# EAGLE design control_board_v2 (EAGLE 8.4.3)
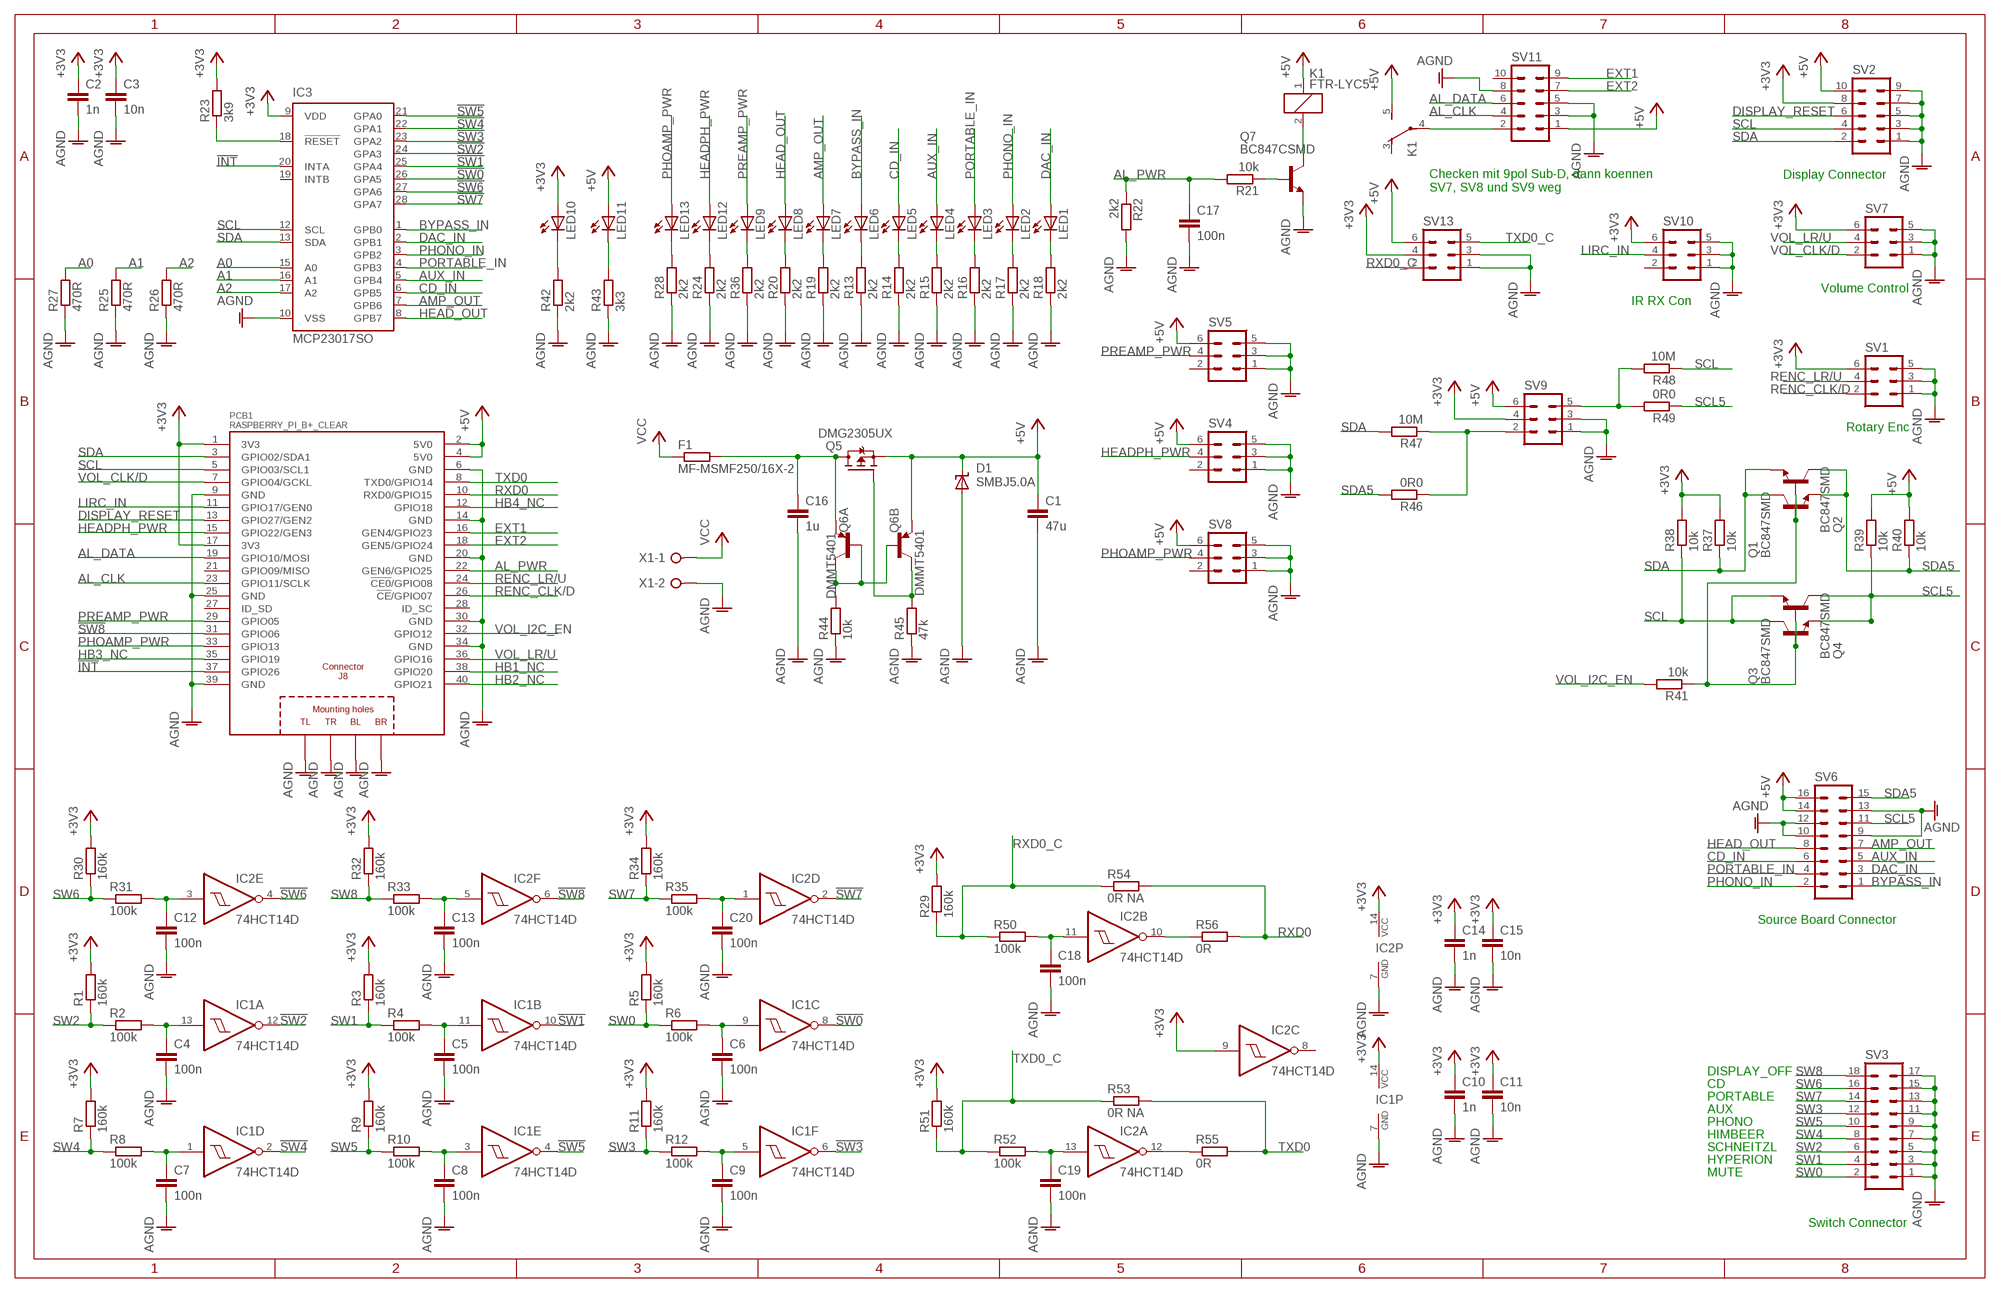
[diagram p0: schematic, sheet 1]

## Parts
C1  47u  C-EUC1812  [C1812]
C2  1n  C-EUC0603  [C0603]
C3  10n  C-EUC0603  [C0603]
C4  100n  C-EUC0603  [C0603]
C5  100n  C-EUC0603  [C0603]
C6  100n  C-EUC0603  [C0603]
C7  100n  C-EUC0603  [C0603]
C8  100n  C-EUC0603  [C0603]
C9  100n  C-EUC0603  [C0603]
C10  1n  C-EUC0603  [C0603]
C11  10n  C-EUC0603  [C0603]
C12  100n  C-EUC0603  [C0603]
C13  100n  C-EUC0603  [C0603]
C14  1n  C-EUC0603  [C0603]
C15  10n  C-EUC0603  [C0603]
C16  1u  C-EUC1206  [C1206]
C17  100n  C-EUC0603  [C0603]
C18  100n  C-EUC0603  [C0603]
C19  100n  C-EUC0603  [C0603]
C20  100n  C-EUC0603  [C0603]
D1  SMBJ5.0A  [SMBJ]
F1  MF-MSMF250/16X-2  R-EU_1812X7R  [1812X7R]
IC1  74HCT14D  [SO14]
IC2  74HCT14D  [SO14]
IC3  MCP23017SO  [SO28W]
K1  FTR-LYC5  [FTR-LYC]
LED1  LEDCHIPLED_0603  [CHIPLED_0603]
LED2  LEDCHIPLED_0603  [CHIPLED_0603]
LED3  LEDCHIPLED_0603  [CHIPLED_0603]
LED4  LEDCHIPLED_0603  [CHIPLED_0603]
LED5  LEDCHIPLED_0603  [CHIPLED_0603]
LED6  LEDCHIPLED_0603  [CHIPLED_0603]
LED7  LEDCHIPLED_0603  [CHIPLED_0603]
LED8  LEDCHIPLED_0603  [CHIPLED_0603]
LED9  LEDCHIPLED_0603  [CHIPLED_0603]
LED10  LEDCHIPLED_0603  [CHIPLED_0603]
LED11  LEDCHIPLED_0603  [CHIPLED_0603]
LED12  LEDCHIPLED_0603  [CHIPLED_0603]
LED13  LEDCHIPLED_0603  [CHIPLED_0603]
PCB1  RASPBERRY_PI_B+_CLEAR  [RASPBERRY_PI_PLUS_CLEAR]
Q1  BC847SMD  [SOT23]
Q2  BC847SMD  [SOT23]
Q3  BC847SMD  [SOT23]
Q4  BC847SMD  [SOT23]
Q5  DMG2305UX  [SOT23]
Q6  DMMT5401  [SOT23-6]
Q7  BC847CSMD  [SOT23]
R1  160k  R-EU_R0603  [R0603]
R2  100k  R-EU_R0603  [R0603]
R3  160k  R-EU_R0603  [R0603]
R4  100k  R-EU_R0603  [R0603]
R5  160k  R-EU_R0603  [R0603]
R6  100k  R-EU_R0603  [R0603]
R7  160k  R-EU_R0603  [R0603]
R8  100k  R-EU_R0603  [R0603]
R9  160k  R-EU_R0603  [R0603]
R10  100k  R-EU_R0603  [R0603]
R11  160k  R-EU_R0603  [R0603]
R12  100k  R-EU_R0603  [R0603]
R13  2k2  R-EU_R0603  [R0603]
R14  2k2  R-EU_R0603  [R0603]
R15  2k2  R-EU_R0603  [R0603]
R16  2k2  R-EU_R0603  [R0603]
R17  2k2  R-EU_R0603  [R0603]
R18  2k2  R-EU_R0603  [R0603]
R19  2k2  R-EU_R0603  [R0603]
R20  2k2  R-EU_R0603  [R0603]
R21  10k  R-EU_R0603  [R0603]
R22  2k2  R-EU_R0603  [R0603]
R23  3k9  R-EU_R1206  [R1206]
R24  2k2  R-EU_R0603  [R0603]
R25  470R  R-EU_R0603  [R0603]
R26  470R  R-EU_R0603  [R0603]
R27  470R  R-EU_R0603  [R0603]
R28  2k2  R-EU_R0603  [R0603]
R29  160k  R-EU_R0603  [R0603]
R30  160k  R-EU_R0603  [R0603]
R31  100k  R-EU_R0603  [R0603]
R32  160k  R-EU_R0603  [R0603]
R33  100k  R-EU_R0603  [R0603]
R34  160k  R-EU_R0603  [R0603]
R35  100k  R-EU_R0603  [R0603]
R36  2k2  R-EU_R0603  [R0603]
R37  10k  R-EU_R1206  [R1206]
R38  10k  R-EU_R0603  [R0603]
R39  10k  R-EU_R0603  [R0603]
R40  10k  R-EU_R0603  [R0603]
R41  10k  R-EU_R1206  [R1206]
R42  2k2  R-EU_R0603  [R0603]
R43  3k3  R-EU_R0603  [R0603]
R44  10k  R-EU_R0603  [R0603]
R45  47k  R-EU_R0603  [R0603]
R46  0R0  R-EU_R0603  [R0603]
R47  10M  R-EU_R0603  [R0603]
R48  10M  R-EU_R0603  [R0603]
R49  0R0  R-EU_R0603  [R0603]
R50  100k  R-EU_R0603  [R0603]
R51  160k  R-EU_R0603  [R0603]
R52  100k  R-EU_R0603  [R0603]
R53  0R NA  R-EU_R0603  [R0603]
R54  0R NA  R-EU_R0603  [R0603]
R55  0R  R-EU_R0603  [R0603]
R56  0R  R-EU_R0603  [R0603]
SV1  MA03-2B  [MA03-2_BORDER]
SV2  MA05-2B  [MA05-2_BORDER]
SV3  MA09-2B  [MA09-2_BORDER]
SV4  MA03-2B  [MA03-2_BORDER]
SV5  MA03-2B  [MA03-2_BORDER]
SV6  MA08-2B  [MA08-2_BORDER]
SV7  MA03-2B  [MA03-2_BORDER]
SV8  MA03-2B  [MA03-2_BORDER]
SV9  MA03-2B  [MA03-2_BORDER]
SV10  MA03-2B  [MA03-2_BORDER]
SV11  MA05-2B  [MA05-2_BORDER]
SV13  MA03-2B  [MA03-2_BORDER]
X1  W237-02P  [W237-132]

## Nets
!INT: IC3.20(INTA) PCB1.37(GPIO26)
!SW0: IC1.8(C:O) IC3.26(GPA5)
!SW1: IC1.10(B:O) IC3.25(GPA4)
!SW2: IC1.12(A:O) IC3.24(GPA3)
!SW3: IC1.6(F:O) IC3.23(GPA2)
!SW4: IC1.2(D:O) IC3.22(GPA1)
!SW5: IC1.4(E:O) IC3.21(GPA0)
!SW6: IC2.4(E:O) IC3.27(GPA6)
!SW7: IC2.2(D:O) IC3.28(GPA7)
!SW8: IC2.6(F:O) PCB1.31(GPIO06)
+3V3: C2.1 C3.1 C10.1 C11.1 C14.1 C15.1 IC1.14(P:VCC) IC2.9(C:I) IC2.14(P:VCC) IC3.9(VDD) LED10.A PCB1.1(3V3) PCB1.17(3V3) R1.2 R3.2 R5.2 R7.2 R9.2 R11.2 R23.2 R29.2 R30.2 R32.2 R34.2 R37.2 R38.2 R51.2 SV1.6 SV2.8 SV7.6 SV9.4 SV10.6 SV13.4
+5V: C1.1 D1.C K1.1 K1.5(-1:S) LED11.A PCB1.2(5V0) PCB1.4(5V0) Q5.2(S) Q6.5(B:E) R39.2 R40.2 SV2.10 SV4.6 SV5.6 SV6.14 SV6.16 SV8.6 SV9.6 SV11.1 SV13.6
A0: IC3.15(A0) R27.2
A1: IC3.16(A1) R25.2
A2: IC3.17(A2) R26.2
AGND: C1.2 C2.2 C3.2 C4.2 C5.2 C6.2 C7.2 C8.2 C9.2 C10.2 C11.2 C12.2 C13.2 C14.2 C15.2 C16.2 C17.2 C18.2 C19.2 C20.2 D1.A IC1.7(P:GND) IC2.7(P:GND) IC3.10(VSS) PCB1.6(GND) PCB1.9(GND) PCB1.14(GND) PCB1.20(GND) PCB1.25(GND) PCB1.30(GND) PCB1.34(GND) PCB1.39(GND) PCB1.PE_BL(BL) PCB1.PE_BR(BR) PCB1.PE_TL(TL) PCB1.PE_TR(TR) Q7.2(E) R13.1 R14.1 R15.1 R16.1 R17.1 R18.1 R19.1 R20.1 R22.2 R24.1 R25.1 R26.1 R27.1 R28.1 R36.1 R42.1 R43.1 R44.1 R45.1 SV1.1 SV1.3 SV1.5 SV2.1 SV2.3 SV2.5 SV2.7 SV2.9 SV3.1 SV3.3 SV3.5 SV3.7 SV3.9 SV3.11 SV3.13 SV3.15 SV3.17 SV4.1 SV4.3 SV4.5 SV5.1 SV5.3 SV5.5 SV6.9 SV6.10 SV6.12 SV6.13 SV7.1 SV7.3 SV7.5 SV8.1 SV8.3 SV8.5 SV9.1 SV9.3 SV10.1 SV10.3 SV10.5 SV11.3 SV11.5 SV11.8 SV13.1 SV13.3 X1.2
AL_CLK: PCB1.23(GPIO11/SCLK) SV11.4
AL_DATA: PCB1.19(GPIO10/MOSI) SV11.6
AL_PWR: C17.1 PCB1.22(GEN6/GPIO25) R21.2 R22.1
AMP_OUT: IC3.7(GPB6) LED7.A SV6.7
AUX_IN: IC3.5(GPB4) LED4.A SV6.5
BYPASS_IN: IC3.1(GPB0) LED6.A SV6.1
CD_IN: IC3.6(GPB5) LED5.A SV6.6
DAC_IN: IC3.2(GPB1) LED1.A SV6.3
DISPLAY_RESET: PCB1.13(GPIO27/GEN2) SV2.6
EXT1: PCB1.16(GEN4/GPIO23) SV11.9
EXT2: PCB1.18(GEN5/GPIO24) SV11.7
HB1_NC: PCB1.38(GPIO20)
HB2_NC: PCB1.40(GPIO21)
HB3_NC: PCB1.35(GPIO19)
HB4_NC: PCB1.12(GPIO18)
HEAD_OUT: IC3.8(GPB7) LED8.A SV6.8
HEADPH_PWR: LED12.A PCB1.15(GPIO22/GEN3) SV4.4
LIRC_IN: PCB1.11(GPIO17/GEN0) SV10.4
N$1: C20.1 IC2.1(D:I) R35.2
N$2: LED13.C R28.2
N$3: LED12.C R24.2
N$4: LED9.C R36.2
N$5: LED8.C R20.2
N$6: LED7.C R19.2
N$7: LED6.C R13.2
N$8: LED3.C R16.2
N$9: LED4.C R15.2
N$10: LED5.C R14.2
N$11: C12.1 IC2.3(E:I) R31.2
N$12: C4.1 IC1.13(A:I) R2.2
N$13: C13.1 IC2.5(F:I) R33.2
N$14: C5.1 IC1.11(B:I) R4.2
N$15: IC3.18(!RESET) R23.1
N$16: C6.1 IC1.9(C:I) R6.2
N$17: Q1.1(B) Q2.1(B) Q3.1(B) Q4.1(B) R41.1
N$18: C7.1 IC1.1(D:I) R8.2
N$19: Q6.1(A:C) Q6.2(A:B) Q6.3(B:B) R44.2
N$20: C8.1 IC1.3(E:I) R10.2
N$21: K1.4(-1:P) SV11.2
N$22: LED11.C R43.2
N$23: C9.1 IC1.5(F:I) R12.2
N$24: LED10.C R42.2
N$25: Q5.1(G) Q6.4(B:C) R45.2
N$26: C16.1 F1.2 Q5.3(D) Q6.6(A:E)
N$27: Q7.1(B) R21.1
N$28: K1.2 Q7.3(C)
N$29: C18.1 IC2.11(B:I) R50.2
N$30: LED1.C R18.2
N$31: C19.1 IC2.13(A:I) R52.2
N$32: IC2.12(A:O) R55.1
N$33: IC2.10(B:O) R56.1
N$34: LED2.C R17.2
N$35: R48.2 R49.2 SV9.5
N$37: R46.1 R47.1 SV9.2
PHOAMP_PWR: LED13.A PCB1.33(GPIO13) SV8.4
PHONO_IN: IC3.3(GPB2) LED2.A SV6.2
PORTABLE_IN: IC3.4(GPB3) LED3.A SV6.4
PREAMP_PWR: LED9.A PCB1.29(GPIO05) SV5.4
RENC_CLK/D: PCB1.26(!CE!/GPIO07) SV1.2
RENC_LR/U: PCB1.24(!CE0!/GPIO08) SV1.4
RXD0: PCB1.10(RXD0/GPIO15) R54.2 R56.2
RXD0_C: R29.1 R50.1 R54.1 SV13.2
SCL: IC3.12(SCL) PCB1.5(GPIO03/SCL1) Q3.3(C) Q4.2(E) R38.1 R48.1 SV2.4
SCL5: Q3.2(E) Q4.3(C) R39.1 R49.1 SV6.11
SDA: IC3.13(SDA) PCB1.3(GPIO02/SDA1) Q1.3(C) Q2.2(E) R37.1 R47.2 SV2.2
SDA5: Q1.2(E) Q2.3(C) R40.1 R46.2 SV6.15
SW0: R5.1 R6.1 SV3.2
SW1: R3.1 R4.1 SV3.4
SW2: R1.1 R2.1 SV3.6
SW3: R11.1 R12.1 SV3.12
SW4: R7.1 R8.1 SV3.8
SW5: R9.1 R10.1 SV3.10
SW6: R30.1 R31.1 SV3.16
SW7: R34.1 R35.1 SV3.14
SW8: R32.1 R33.1 SV3.18
TXD0: PCB1.8(TXD0/GPIO14) R53.2 R55.2
TXD0_C: R51.1 R52.1 R53.1 SV13.5
VCC: F1.1 X1.1
VOL_CLK/D: PCB1.7(GPIO04/GCKL) SV7.2
VOL_I2C_EN: PCB1.32(GPIO12) R41.2
VOL_LR/U: PCB1.36(GPIO16) SV7.4
Unconnected: IC2.8(C:O) IC3.19(INTB) K1.3(-1:O) PCB1.21(GPIO09/MISO) PCB1.27(ID_SD) PCB1.28(ID_SC) SV4.2 SV5.2 SV8.2 SV10.2 SV11.10

## Notes on the sheet
- Display Connector
- Checken mit 9pol Sub-D, dann koennen
  SV7, SV8 und SV9 weg
- Volume Control
- IR RX Con
- Rotary Enc
- Source Board Connector
- DISPLAY_OFF
- CD
- PORTABLE
- AUX
- PHONO
- HIMBEER
- SCHNEITZL
- HYPERION
- MUTE
- Switch Connector

## Library data of the parts
C1-C20 = rcl:C-EU: CAPACITOR, European symbol
D1 = diode:SMBJ5.0A
F1 R1-R36 R40 R42-R56 = rcl:R-EU_: RESISTOR, European symbol
IC1 IC2 = 74xx-eu:74*14: Hex schmitt trigger INVERTER
IC3 = microchip:MCP23017: http://ww1.microchip.com/downloads/en/DeviceDoc/21952a.pdf Source: http://ww1.microchip.com/downloads/en/DeviceDoc/21952a.pdf; MF: MICROCHIP; MPN: MCP23017-E/SO; OC_FARNELL: 1332087; OC_NEWARK: 31K2958
K1 = relay:FTR-LYC: Schmales Netzrelais NETZRELAIS FTR-LYCA024V 1XUM 6A/250VAC Distributor: Conrad electronic Bestell Nr.: 504382 - 62 Source: http://www2.produktinfo.conrad.com/datenblaetter/500000-524999/504382-da-01-de-NETZRELAIS_FTR-LYCA024V_1XUM_6A_250VAC.pdf; OC_FARNELL: unknown; OC_NEWARK: unknown
LED1-LED13 = led:LED: LED OSRAM: - CHIPLED LG R971, LG N971, LY N971, LG Q971, LY Q971, LO R971, LY R971 LH N974, LH R974 LS Q976, LO Q976, LY Q976 LO Q996 - Hyper CHIPLED LW Q18S LB Q993, LB Q99A, LB R99A - SideLED LS A670, LO A670, LY A670, LG A670, LP A670 LB A673, LV A673, LT A673, LW A673 LH A674 LY A675 LS A676, LA A676, LO A676, LY A676, LW A676 LS A679, LY A679, LG A679 - Hyper Micro SIDELED® LS Y876, LA Y876, LO Y876, LY Y876 LT Y87S - SmartLED LW L88C, LW L88S LB L89C, LB L89S, LG L890 LS L89K, LO L89K, LY L89K LS L896, LA L896, LO L896, LY L896 - TOPLED LS T670, LO T670, LY T670, LG T670, LP T670 LSG T670, LSP T670, LSY T670, LOP T670, LYG T670 LG T671, LOG T671, LSG T671 LB T673, LV T673, LT T673, LW T673 LH T674 LS T676, LA T676, LO T676, LY T676, LB T676, LH T676, LSB T676, LW T676 LB T67C, LV T67C, LT T67C, LS T67K, LO T67K, LY T67K, LW E67C LS E67B, LA E67B, LO E67B, LY E67B, LB E67C, LV E67C, LT E67C LW T67C LS T679, LY T679, LG T679 LS T770, LO T770, LY T770, LG T770, LP T770 LB T773, LV T773, LT T773, LW T773 LH T774 LS E675, LA E675, LY E675, LS T675 LS T776, LA T776, LO T776, LY T776, LB T776 LHGB T686 LT T68C, LB T68C - Hyper Mini TOPLED® LB M676 - Mini TOPLED Santana® LG M470 LS M47K, LO M47K, LY M47K Source: http://www.osram.convergy.de LUXEON: - LUMILED® LXK2-PW12-R00, LXK2-PW12-S00, LXK2-PW14-U00, LXK2-PW14-V00 LXK2-PM12-R00, LXK2-PM12-S00, LXK2-PM14-U00 LXK2-PE12-Q00, LXK2-PE12-R00, LXK2-PE12-S00, LXK2-PE14-T00, LXK2-PE14-U00 LXK2-PB12-K00, LXK2-PB12-L00, LXK2-PB12-M00, LXK2-PB14-N00, LXK2-PB14-P00, LXK2-PB14-Q00 LXK2-PR12-L00, LXK2-PR12-M00, LXK2-PR14-Q00, LXK2-PR14-R00 LXK2-PD12-Q00, LXK2-PD12-R00, LXK2-PD12-S00 LXK2-PH12-R00, LXK2-PH12-S00 LXK2-PL12-P00, LXK2-PL12-Q00, LXK2-PL12-R00 Source: www.luxeon.com KINGBRIGHT: KA-3528ASYC Source: www.kingbright.com
PCB1 = RASPBERRY_PI_Bplus:RASPBERRY_PI_B+: Raspberry Pi B+ Basedon issue: Thursday, July 10, 2014 - Rev 1.2 LBR by Tim Rettmann 07-2014
Q1-Q4 Q7 = transistor-npn:BC847*: NPN Transistor
Q5 = transistor-fet:DMG2305UX
Q6 = transistor-pnp:DMMT5401
R37-R39 R41 = resistor:R-EU_: RESISTOR, European symbol
SV1 SV4 SV5 SV7-SV10 SV13 = con-lstb:MA03-2: PIN HEADER
SV2 SV11 = con-lstb:MA05-2: PIN HEADER
SV3 = con-lstb:MA09-2: PIN HEADER
SV6 = con-lstb:MA08-2: PIN HEADER
X1 = con-wago-508:W237-02P: WAGO SREW CLAMP; OC_FARNELL: unknown; OC_NEWARK: unknown

## Board
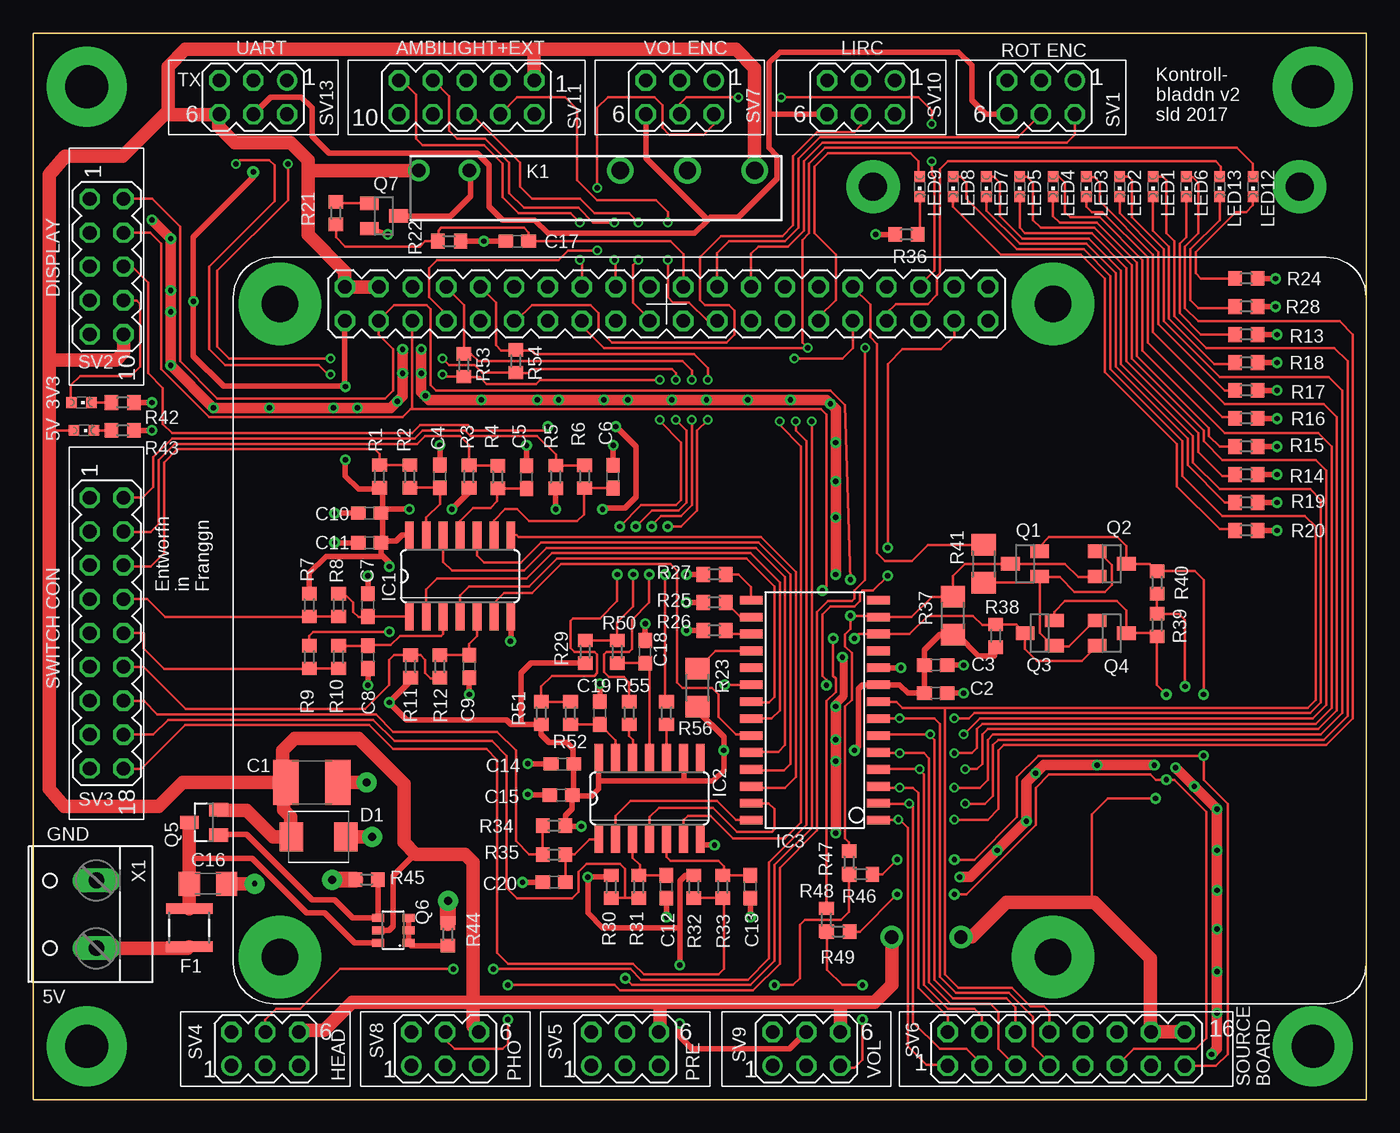
[diagram p1: board, top side]
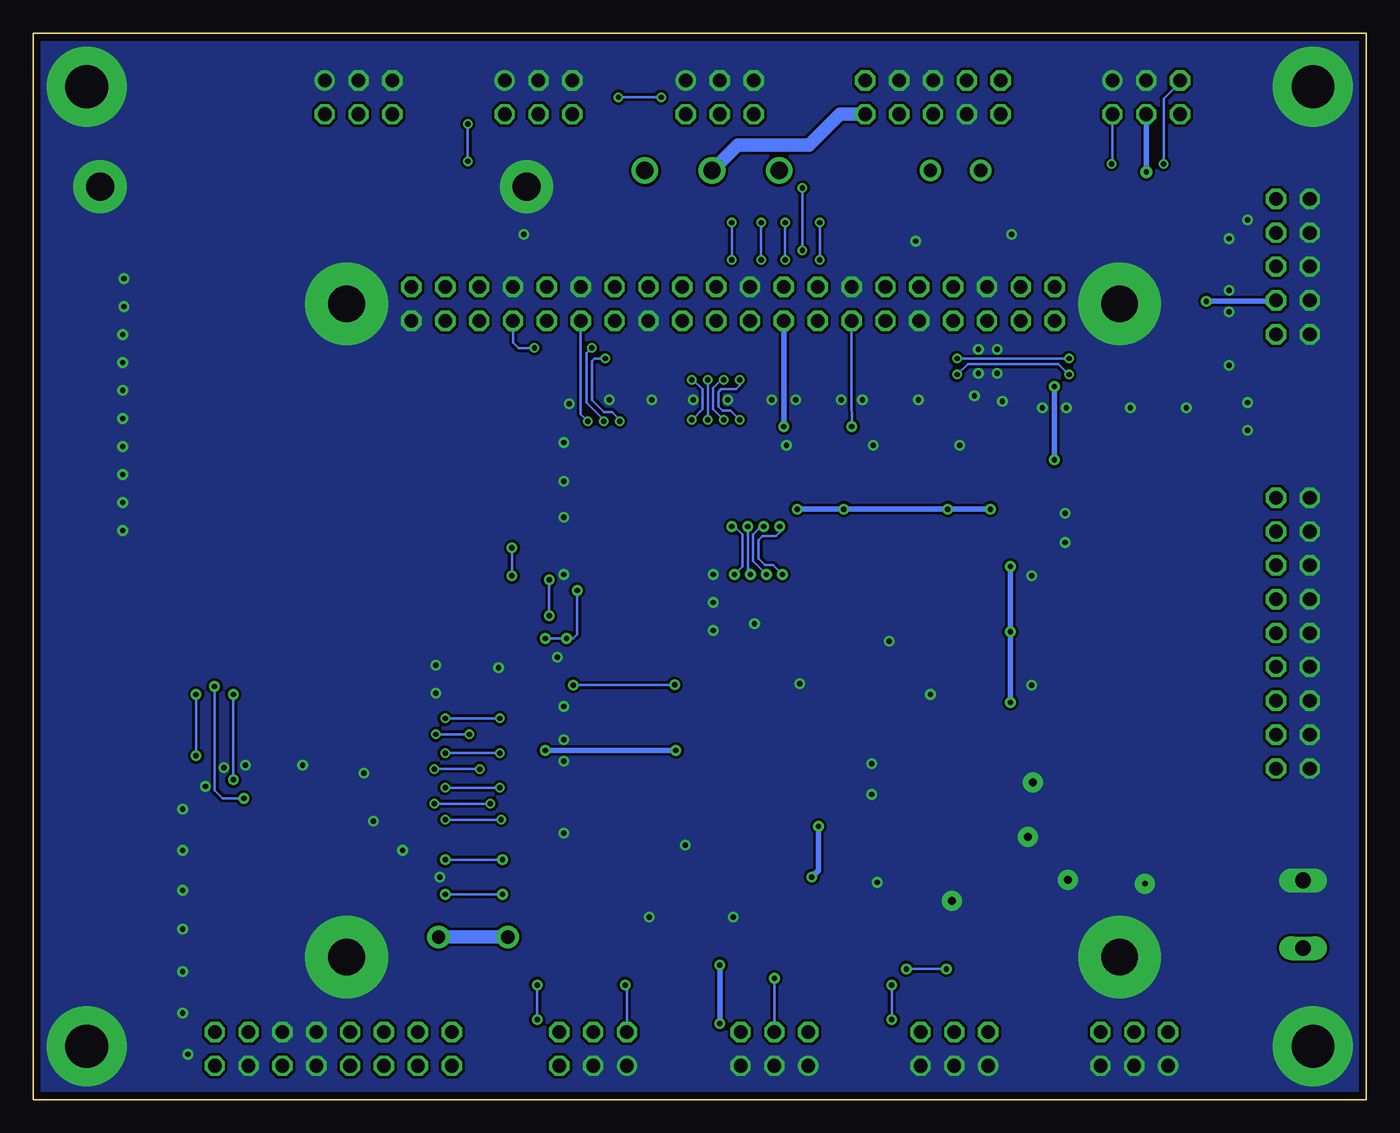
[diagram p2: board, bottom side, seen from below]

Size 100 x 80 mm. Coordinates in mm from the lower left corner, seen from the top.
Outline: 0,0 100,0 100,80 0,80 0,0
Copper layers (1*16): Top 0.035mm / dielectric 1.6mm / Bottom 0.035mm
Design rules "Elecrow_2-layer_PCB_eagle_rule": minimum track width 6mil, minimum drill 12mil, track to track 6mil, track to pad 8mil, pad to pad 12mil, via to via 12mil, smd to smd 0mil, copper to edge 20mil, drill to drill 10mil, minimum pad ring 6mil, minimum via ring 6mil, stop-mask expansion 0mil, vias tented up to drill 100mil, thermal gap 10mil

### Footprints (pad centres in the part's own frame; a part is rotated, then mirrored left to right if it is on the bottom)
C1812 = smd 1.9 x 3.4: 1 -1.95,0; 2 1.95,0
C0603 = smd 1.1 x 1: 1 -0.85,0; 2 0.85,0
C1206 = smd 1.6 x 1.8: 1 -1.4,0; 2 1.4,0
SMBJ = smd 1.78 x 2.16: A 2.04,0; C -2.03,0
1812X7R = smd 0.8 x 3.5: 1 -1.425,0; 2 1.425,0
SO14 = smd 0.66 x 2.032: 1 -3.81,-3.073; 2 -2.54,-3.073; 3 -1.27,-3.073; 4 0,-3.073; 5 1.27,-3.073; 6 2.54,-3.073; 7 3.81,-3.073; 8 3.81,3.073; 9 2.54,3.073; 10 1.27,3.073; 11 0,3.073; 12 -1.27,3.073; 13 -2.54,3.073; 14 -3.81,3.073
SO28W = smd 0.65 x 1.7: 1 -7.62,-4.78; 2 -6.35,-4.78; 3 -5.08,-4.78; 4 -3.81,-4.78; 5 -2.54,-4.78; 6 -1.27,-4.78; 7 0,-4.78; 8 1.27,-4.78; 9 2.54,-4.78; 10 3.81,-4.78; 11 5.08,-4.78; 12 6.35,-4.78; 13 7.62,-4.78; 14 8.89,-4.78; 15 8.89,4.78; 16 7.62,4.78; 17 6.35,4.78; 18 5.08,4.78; 19 3.81,4.78; 20 2.54,4.78; 21 1.27,4.78; 22 0,4.78; 23 -1.27,4.78; 24 -2.54,4.78; 25 -3.81,4.78; 26 -5.08,4.78; 27 -6.35,4.78; 28 -7.62,4.78
FTR-LYC = drill 1 pad 1.6: 1 -3.78,0; 2 0,0 | drill 1.3 pad 2: 3 11.34,0; 4 16.38,0; 5 21.42,0
CHIPLED_0603 = smd 0.8 x 0.8: A 0,-0.75; C 0,0.75
RASPBERRY_PI_PLUS_CLEAR = drill 1.016 octagon: 1 8.37,51.23; 2 8.37,53.77; 3 10.91,51.23; 4 10.91,53.77; 5 13.45,51.23; 6 13.45,53.77; 7 15.99,51.23; 8 15.99,53.77; 9 18.53,51.23; 10 18.53,53.77; 11 21.07,51.23; 12 21.07,53.77; 13 23.61,51.23; 14 23.61,53.77; 15 26.15,51.23; 16 26.15,53.77; 17 28.69,51.23; 18 28.69,53.77; 19 31.23,51.23; 20 31.23,53.77; 21 33.77,51.23; 22 33.77,53.77; 23 36.31,51.23; 24 36.31,53.77; 25 38.85,51.23; 26 38.85,53.77; 27 41.39,51.23; 28 41.39,53.77; 29 43.93,51.23; 30 43.93,53.77; 31 46.47,51.23; 32 46.47,53.77; 33 49.01,51.23; 34 49.01,53.77; 35 51.55,51.23; 36 51.55,53.77; 37 54.09,51.23; 38 54.09,53.77; 39 56.63,51.23; 40 56.63,53.77 | drill 2.75 pad 6.2: PE_BL 3.5,3.5; PE_BR 61.5,3.5; PE_TL 3.5,52.5; PE_TR 61.5,52.5
SOT23 = smd 1 x 1.4: 1 -0.95,-1.1; 2 0.95,-1.1; 3 0,1.1
SOT23-6 = smd 0.6 x 0.9: 1 -0.95,-1.15; 2 0,-1.15; 3 0.95,-1.15; 4 0.95,1.15; 5 0,1.15; 6 -0.95,1.15
R0603 = smd 1 x 1.1: 1 -0.85,0; 2 0.85,0
R1206 = smd 1.6 x 1.803: 1 -1.422,0; 2 1.422,0
MA03-2_BORDER = drill 1.016: 1 -2.54,-1.27 | drill 1.016 octagon: 2 -2.54,1.27; 3 0,-1.27; 4 0,1.27; 5 2.54,-1.27; 6 2.54,1.27
MA05-2_BORDER = drill 1.016 octagon: 1 -5.08,-1.27; 2 -5.08,1.27; 3 -2.54,-1.27; 4 -2.54,1.27; 5 0,-1.27; 6 0,1.27; 7 2.54,-1.27; 8 2.54,1.27; 9 5.08,-1.27; 10 5.08,1.27
MA09-2_BORDER = drill 1.016 octagon: 1 -10.16,-1.27; 2 -10.16,1.27; 3 -7.62,-1.27; 4 -7.62,1.27; 5 -5.08,-1.27; 6 -5.08,1.27; 7 -2.54,-1.27; 8 -2.54,1.27; 9 0,-1.27; 10 0,1.27; 11 2.54,-1.27; 12 2.54,1.27; 13 5.08,-1.27; 14 5.08,1.27; 15 7.62,-1.27; 16 7.62,1.27; 17 10.16,-1.27; 18 10.16,1.27
MA08-2_BORDER = drill 1.016 octagon: 1 -8.89,-1.27; 2 -8.89,1.27; 3 -6.35,-1.27; 4 -6.35,1.27; 5 -3.81,-1.27; 6 -3.81,1.27; 7 -1.27,-1.27; 8 -1.27,1.27; 9 1.27,-1.27; 10 1.27,1.27; 11 3.81,-1.27; 12 3.81,1.27; 13 6.35,-1.27; 14 6.35,1.27; 15 8.89,-1.27; 16 8.89,1.27
W237-132 = drill 1.194 long: 1 -2.54,-0.635; 2 2.54,-0.635

### Placement (x,y rotation side)
C1  20.9,23.8 0 top
C2  67.7,30.5 0 top
C3  67.7,32.6 0 top
C4  30.51,46.76 90 top
C5  37.01,46.69 90 top
C6  43.49,46.73 90 top
C7  25.1,37.1 90 top
C8  25.1,33.2 270 top
C9  32.7,32.5 270 top
C10  25.23,44 180 top
C11  25.23,41.77 180 top
C12  47.49,15.97 270 top
C13  53.79,15.97 270 top
C14  39.69,25.18 180 top
C15  39.59,22.85 180 top
C16  13.1,16.2 0 top
C17  36.3,64.4 180 top
C18  45.9,33.6 90 top
C19  42.5,29 90 top
C20  39.07,16.32 180 top
D1  21.4,19.7 0 top
F1  11.7,12.9 90 top
IC1  32.02,39.28 0 top
IC2  46.23,22.6 0 top
IC3  58.63,28.58 90 top
K1  32.7,69.7 0 top
LED1  84,68.5 180 top
LED2  81.5,68.5 180 top
LED3  79,68.5 180 top
LED4  76.5,68.5 180 top
LED5  74,68.5 180 top
LED6  86.5,68.5 180 top
LED7  71.5,68.5 180 top
LED8  69,68.5 180 top
LED9  66.5,68.5 180 top
LED10  3.6,52.3 270 top
LED11  3.8,50.2 270 top
LED12  91.5,68.5 180 top
LED13  89,68.5 180 top
PCB1  15,7.2 0 top
Q1  74.4,40.2 90 top
Q2  80.9,40.2 270 top
Q3  75.5,35 90 top
Q4  80.9,35 270 top
Q5  12.8,20.8 90 top
Q6  27,12.7 90 top
Q7  26.3,66.3 270 top
R1  25.98,46.76 270 top
R2  28.24,46.76 270 top
R3  32.69,46.74 270 top
R4  34.84,46.71 270 top
R5  39.19,46.72 270 top
R6  41.36,46.73 270 top
R7  20.7,37.1 90 top
R8  22.9,37.1 90 top
R9  20.7,33.2 90 top
R10  22.9,33.2 90 top
R11  28.3,32.5 270 top
R12  30.5,32.5 90 top
R13  91,57.4 180 top
R14  91,46.9 180 top
R15  91,49 180 top
R16  91,51.1 180 top
R17  91,53.2 180 top
R18  91,55.3 180 top
R19  91,44.8 180 top
R20  91,42.7 180 top
R21  22.7,66.5 270 top
R22  31.2,64.4 0 top
R23  49.83,30.9 270 top
R24  91,61.6 180 top
R25  51.1,37.3 0 top
R26  51.1,35.2 0 top
R27  51.1,39.4 0 top
R28  91,59.5 180 top
R29  41.4,33.6 270 top
R30  43.35,15.97 90 top
R31  45.42,15.97 90 top
R32  49.55,15.97 90 top
R33  51.72,15.97 90 top
R34  39.07,20.55 0 top
R35  39.07,18.39 0 top
R36  65.5,64.9 0 top
R37  69,36.3 270 top
R38  72.2,34.8 270 top
R39  84.3,35.6 90 top
R40  84.3,38.8 270 top
R41  71.3,40.2 90 top
R42  6.7,52.3 180 top
R43  6.7,50.2 180 top
R44  31.1,12.4 270 top
R45  25,16.5 0 top
R46  62.1,16.9 0 top
R47  61.2,17.8 90 top
R48  59.5,13.5 270 top
R49  60.4,12.6 180 top
R50  43.8,33.6 270 top
R51  38.1,29 270 top
R52  40.3,29 270 top
R53  32.3,55.1 90 top
R54  36.2,55.4 90 top
R55  44.7,29 90 top
R56  47.5,29 90 top
SV1  75.6,75.2 180 top
SV2  5.5,62.5 270 top
SV3  5.5,35 270 top
SV4  17.4,3.8 0 top
SV5  44.4,3.8 0 top
SV6  77.5,3.8 0 top
SV7  48.5,75.2 180 top
SV8  30.9,3.8 0 top
SV9  58,3.8 0 top
SV10  62.1,75.2 180 top
SV11  32.5,75.2 180 top
SV13  16.5,75.2 180 top
X1  4.1,13.9 90 top

### Tracks (layer width: path | path; a pad name or v marks a point on that pad's centre or on a via)
!INT  (via drill 0.4 pad 0.8)
  Top 0.2: IC3.20 v51.88,31.12 | v64.1,41.4 64.1,55.2 65.2,56.3 68.1,56.3 69.09,57.29 PCB1.37 | v64.1,39.3 63,38.2 62.2,38.2 62,38 62,37.4 61.6,37 59.8,37 59.2,36.4 59.2,31.8 59.5,31.5 v59.5,31.1
  Bottom 0.2: v64.1,39.3 v64.1,41.4 | v59.5,31.1 51.9,31.1 v51.88,31.12
!SW0
  Top 0.2: IC3.26 53.95,23.4 56.4,23.4 57.2,24.2 57.2,39.6 54.6,42.2 36.4,42.2 36.25,42.35 IC1.8
!SW1
  Top 0.2: IC1.10 33.29,40.81 33.8,40.3 36.6,40.3 38.1,41.8 54.4,41.8 56.8,39.4 56.8,25.2 56.3,24.7 53.92,24.7 IC3.25
!SW2
  Top 0.2: IC1.12 30.75,40.35 31.4,39.7 36.8,39.7 38.5,41.4 54.2,41.4 56.4,39.2 56.4,26.6 55.9,26.1 53.91,26.1 IC3.24
!SW3
  Top 0.2: IC1.6 34.56,37.26 35.3,38 37.4,38 39.6,40.2 47.8,40.2 48.3,39.7 48.3,31.3 48.7,30.9 50.9,30.9 51.4,30.4 51.4,28.7 52.7,27.4 53.76,27.4 IC3.23
!SW4
  Top 0.2: IC1.2 29.48,38.28 30.3,39.1 37,39.1 38.9,41 53.8,41 56,38.8 56,29.2 55.38,28.58 IC3.22
!SW5
  Top 0.2: IC1.4 32.02,37.82 32.7,38.5 37.2,38.5 39.3,40.6 53.5,40.6 55.6,38.5 55.6,30.2 55.2,29.8 53.9,29.8 IC3.21
!SW6
  Top 0.2: IC2.4 46.23,21.2 46.93,21.9 51,21.9 52.8,20.1 55.4,20.1 55.6,20.3 55.6,21.8 55.17,22.23 IC3.27 53.88,22.2
!SW7
  Top 0.2: IC2.2 43.69,21.3 44.79,22.4 51.3,22.4 52.7,21 53.81,21 IC3.28
!SW8  (via drill 0.4 pad 0.6)
  Top 0.2: IC2.6 48.77,20.97 49.1,21.3 50.8,21.3 52.5,19.6 56.4,19.6 57.6,20.8 57.6,49 56,50.6 v56,50.9 | PCB1.31 61.5,58.4 61.5,56.4 60.7,55.6 v57.1,55.6
  Bottom 0.2: v56,50.9 56,51 56.6,51.6 57.2,51.6 58.1,52.5 58.1,55.4 57.9,55.6 v57.1,55.6
+3V3  (via drill 0.4 pad 0.8, 0.4 pad 0.9)
  Top 0.2: C10.1 26.1,44 26.2,44.1 | 26.2,41.9 C11.1 26.1,41.75 | 26.2,45.69 R1.2 | 40.54,22.95 C15.1 40.49,22.8 | C10.1 | v39.19,44.31 v39.2,44.3 | R3.2 32.69,45.59 | 26.37,44.3 C10.1 | 26.9,41.9 | 40.4,25.32 C14.1 | 43.23,16.7 R30.2 | SV2.8 7.74,59.96 8,59.7 8,55 7.3,54.3 3.5,54.3 2.8,53.6 2.8,52.35 LED10.A | R9.2 20.7,34.8 21,35.1 v26.7,35.1
  Top 0.4: 26.2,45.69 26.2,44.1 26.2,41.9 26.9,41.9 | 40.54,22.95 C14.1 40.5,25.22 40.5,26.3 40,26.8 38.7,26.8 38.1,27.4 R51.2 36.5,28.15 | R38.2 72.12,33.3 70.9,33.3 69.32,34.88 R37.2 68.98,34.9 68,34.9 66.85,33.75 C3.1 C2.1 65.6,30.5 64.98,31.12 IC3.9 62.22,31.12 61.9,30.8 61.9,26.5 v61.6,26.2 | R5.2 v39.19,44.31 | 32.69,45.59 v31.4,44.3 | v28.2,44.3 26.37,44.3 | IC1.14 27.65,42.35 27.2,41.9 26.9,41.9 | v26.7,40 26.7,40.3 26.25,40.75 | 26.25,40.75 26.1,40.9 26.1,41.75 | IC2.14 42.42,24 | 42.42,24 42.42,23.32 41.9,22.8 40.49,22.8 | 43.23,16.7 v41.6,16.7 41.6,14 42.7,12.9 48.5,12.9 | SV1.6 71.47,73.93 70.4,75 70.4,77.6 69.4,78.6 56,78.6 55.2,77.8 55.2,74 | SV13.4 16.53,73.93 17.8,75.2 20.1,75.2 20.9,74.4 20.9,72.3 22.2,71 33.3,71 34.2,70.1 34.2,67 35.2,66 37.6,66 38.6,65 49.6,65 50.6,66 | SV9.4 56.73,3.8 49.4,3.8 48.5,4.7 v48.5,5.7 | R32.2 48.92,16.82 48.5,16.4 48.5,12.9 | R7.2 20.7,39.5 21.95,40.75 26.25,40.75 | R11.2 28.3,31.4 v26.7,29.8 28,28.5 35.5,28.5 35.85,28.15 36.5,28.15 | 48.9,23.9 51,23.9 51.8,24.7 v51.8,26.2 51.8,27.2 49.83,29.17 R23.2 | 48.9,23.9 42.52,23.9 42.42,24 | IC2.9 48.8,25.64 48.8,24 48.9,23.9 | 36.5,28.15 36.6,28.25 36.6,32 37.35,32.75 R29.2 | v16.5,69.6 16.5,69.2 12,64.7 v12,59.9 12,55.8 14.27,53.53 23.37,53.53 | v42.7,44.3 42.8,44.4 44.4,44.4 45.2,45.2 45.2,49 v43.7,50.5 | PCB1.1 23.37,53.53 | 23.37,53.53 v23.4,53.5 | v23.4,48 23.4,46.8 24.4,45.8 25.87,45.8 R1.2 | v41.1,20.5 39.98,20.5 R34.2 39.92,21.32 40.4,21.8 40.4,22.8 C15.1 | 48.5,12.9 v48.5,10.1 | SV10.6 55.27,73.93 55.2,74 | 55.2,74 55.2,71.4 55.8,70.8 55.8,69.1 52.9,66.2 50.8,66.2 50.6,66 | SV7.6 45.96,70.64 50.6,66
  Bottom 0.4: v28.2,44.3 v31.4,44.3 v39.2,44.3 v42.7,44.3 | v12,59.9 6.83,59.9 SV2.8 | PCB1.17 43.69,52.51 v43.7,50.5 | v51.8,26.2 v61.6,26.2 | v26.7,40 v26.7,35.1 v26.7,29.8 | v16.5,69.6 SV13.4 | v23.4,53.5 v23.4,48 | v41.1,20.5 41.1,17.2 v41.6,16.7 | v48.5,10.1 v48.5,5.7
+5V  (via drill 0.4 pad 0.8, 1 pad 1.7)
  Top 0.2: 1.4,51 1.2,51.4 | LED11.A 1.2,50.2 | 83.8,10.8 83.7,10.7 | R40.2 R39.2 85.95,36.45 86.4,36 v86.4,31 | v84.2,22.6 80.6,22.6 79.4,21.4 79.4,14.8
  Top 0.4: Q6.5 26.7,12.7 27,13 27,16.8 28.65,18.45 | 32.8,17.6 33,17.4
  Top 1: C1.1 18.77,23.62 18.77,21.73 19.3,21.2 19.3,19.77 D1.C 18,19.7 16,21.7 13.95,21.7 Q5.2 | C1.1 11.2,23.8 9.4,22 2.3,22 1.2,23.3 1.2,50.2 1.2,51.4 1.2,55.5 | C1.1 18.8,23.8 18.7,23.9 18.7,26.2 19.6,27.1 24.4,27.1 27.8,23.7 27.8,19.3 28.65,18.45 28.7,18.4 32.4,18.4 33,17.8 33,17.4 33,7.3 | 47,7.3 33,7.3 | 33,7.3 23.9,7.3 21.8,5.2 20.07,5.2 SV4.6 | 60.8,7.3 63.1,7.3 64.4,8.6 v64.4,12.2 | 60.8,7.3 47,7.3 | 1.2,55.5 1.2,69.4 2.4,70.8 6.7,70.8 9.8,73.9 10.1,73.9 | PCB1.4 PCB1.2 23.37,62.13 20.6,64.9 20.6,70 | 10.1,73.9 13.93,73.9 SV13.6 13.9,73.87 13.9,73 15.1,71.8 19.3,71.8 20.6,70.5 20.6,70 | SV2.10 6.77,56.07 6.2,55.5 1.2,55.5 | v69.6,12.2 70.4,12.2 73,14.8 79.4,14.8 79.6,14.8 83.7,10.7 83.8,10.6 83.8,5.12 SV6.14 SV6.16 | SV5.6 47,5.07 47,7.3 | SV8.6 33,5.51 33,7.3 | SV9.6 60.54,7.04 60.8,7.3 | 10.1,73.9 10.1,77.5 11.4,78.8 37.4,78.8 | 37.4,78.8 52.7,78.8 54.12,77.38 K1.5 | SV11.1 37.58,78.62 37.4,78.8 | K1.1 20.9,69.7 20.6,70
  Bottom 0.2: v86.4,31 86.4,23.2 85.8,22.6 v84.2,22.6
  Bottom 1: v64.4,12.2 v69.6,12.2
A0
  Top 0.2: IC3.15 53.85,38.45 52.9,39.4 R27.2
A1
  Top 0.2: IC3.16 53.05,36.2 R25.2
A2
  Top 0.2: IC3.17 52.22,34.93 R26.2
AGND  (via drill 0.4 pad 0.8, 0.4 pad 1.5, 0.6 pad 1.5, 2.1 pad 4, 3.2 pad 6)
  Top 0.2: v30.51,49.09 v30.5,49.1 | v37.01,49.09 v37,49.1 | v43.49,49.09 v43.5,49.1 | 63.42,32.4 IC3.10 | 38.21,16.3 C20.2 | C12.2 | C13.2
  Top 0.4: C10.2 v22.6,44 | C11.2 22.63,41.77 v22.6,41.8 | C4.2 v30.51,49.09 | C5.2 v37.01,49.09 | C6.2 v43.49,49.09 | C14.2 37.12,25.18 v37.1,25.2 | C15.2 37.15,22.85 v37.1,22.9 | v36.7,16.3 38.21,16.3 | IC3.10 v65.1,32.4 | v25.1,39.3 C7.2 | C8.2 v25.1,31.1 | C9.2 v32.7,30.4 | R27.1 v49,39.4 | R25.1 v49,37.3 | R26.1 v49,35.2 | C19.2 v42.5,31.2 | C18.2 v45.9,35.7 | Q7.2 v26.6,64.9 | C17.2 v33.8,64.4 R22.2 | v8.9,52.3 R42.1 | v8.9,50.2 R43.1 | IC1.7 35.83,34.43 v35.8,34.4 | v51.1,19.1 50.2,19.1 50.1,19 50.1,19.46 IC2.7 | C13.2 v53.8,13.7 | C12.2 v47.5,13.7 | C3.2 v69.8,32.6 | C2.2 v69.8,30.5 | R20.1 v93.3,42.7 | R19.1 v93.3,44.8 | R14.1 v93.3,46.9 | R15.1 v93.3,49 | R16.1 v93.3,51.1 | R17.1 v93.3,53.2 | R18.1 v93.3,55.3 | R13.1 v93.3,57.4 | R28.1 v93.2,59.5 | R24.1 v93.2,61.6 | R36.1 v63.2,64.9
  Top 0.6: v60.2,29.5 60.2,29.7 60.8,30.3 60.8,33.2 60.7,33.3
  Top 0.8: v29.1,56.3 29.1,53.1 29.7,52.5 59.5,52.5 60.2,51.8 v60.2,39.4 | v27.7,56.3 27.7,52.8 26.8,51.9 v13.5,51.9 v10.3,55.1 v10.3,64.6 v8.9,66 | v60.2,29.5 v60.2,20 | v84.1,25.1 75.8,25.1 74.5,23.8 v74.5,20.9 70.3,16.7 v69.5,16.7 | v88.4,3.4 88.8,3.8 v88.8,21.8 v85.7,24.9
  Top 1: C16.2 v16.6,16.2 | C1.2 v25,23.8 | D1.A v25.4,19.7
  Top 1.2: R45.1 v22.4,16.5 | R44.1 v31.1,14.9
  other vias: 63,68.5 95,68.5 4,76 96,76 96,4 4,4 29.4,52.8 37.8,52.5 39.4,52.5 42.8,52.5 44.6,52.5 50.5,52.5 59.8,52.2 60.2,49.3 60.2,46.4 60.2,43.7 56.8,52.5 53.6,52.5 47.9,52.5 33.6,52.5 27.7,54.5 29.1,54.5 27.3,52.4 22.5,51.9 17.7,51.9 10.3,59.1 10.3,60.7 24.3,51.9 60.2,27 60.2,25.4 60.7,33.2 75.2,24.5 79.8,25.1 72.3,18.7 87.1,23.5 88.8,18.7 88.8,15.7 88.8,12.8 88.8,9.6 88.8,6.5
  pour Bottom (isolate 0.2, no thermals): 0,79.91 100.33,79.91 100.33,0 0,0
AL_CLK  (via drill 0.4 pad 0.6)
  Top 0.2: PCB1.23 50.57,58.43 49.2,59.8 48,59.8 47.6,60.2 v47.6,63 | v47.6,65.8 47.6,66.6 46.7,67.5 42.3,67.5 40.8,69 40.8,74.3 39.9,75.2 36.3,75.2 SV11.4
  Bottom 0.2: v47.6,63 v47.6,65.8
AL_DATA  (via drill 0.4 pad 0.6)
  Top 0.2: PCB1.19 46.23,58.57 45,59.8 45,62.6 v45.4,63 | SV11.6 32.87,73.93 36.5,70.3 36.5,68.5 37.4,67.6 41,67.6 42.1,66.5 44.7,66.5 v45.4,65.8
  Bottom 0.2: v45.4,65.8 v45.4,63
AL_PWR
  Top 0.2: PCB1.22 48.77,63.43 47.8,64.4 C17.1 37.15,65.05 36.8,65.4 30.6,65.4 30.4,65.2 30.4,64.45 R22.1 29.4,64.4 29,64 23.4,64 22.7,64.7 R21.2
AMP_OUT  (via drill 0.4 pad 0.6)
  Top 0.2: IC3.7 63.43,28.6 v65,28.6 67.6,28.6 68,28.2 68,9.2 69.2,8 73.2,8 75,6.2 75,4 76.23,2.77 SV6.7 | v69.1,28.6 70.2,28.6 70.6,29 95.8,29 96.6,29.8 96.6,45 95.8,45.8 89,45.8 87,47.8 87,49.8 81.6,55.2 81.6,62.2 79.2,64.6 74.2,64.6 72.5,66.3 72.5,68.8 72.05,69.25 LED7.A
  Bottom 0.2: v65,28.6 v69.1,28.6
AUX_IN  (via drill 0.4 pad 0.6)
  Top 0.2: IC3.5 63.45,26 v65,26 66.8,26 67.2,25.6 67.2,8.8 68.8,7.2 71.8,7.2 72.4,6.6 72.4,3.8 73.67,2.53 SV6.5 | v69.1,26 70.4,26 70.8,26.4 70.8,27.8 71.2,28.2 96.2,28.2 97.4,29.4 97.4,49 96.4,50 89.4,50 83.2,56.2 83.2,63 80,66.2 77.8,66.2 77.4,66.6 77.4,68.8 76.95,69.25 LED4.A
  Bottom 0.2: v65,26 v69.1,26
BYPASS_IN  (via drill 0.4 pad 0.6)
  Top 0.2: IC3.1 63.45,21 v64.9,21 65,21 65.6,20.4 65.6,4 65.9,3.7 67,2.6 68.54,2.6 SV6.1 | v69.1,21 71.6,21 72.4,21.8 72.4,26.2 72.8,26.6 97,26.6 99,28.6 99,57.4 98,58.4 87.4,58.4 86.4,59.4 86.4,64 87.4,65 87.4,68.8 87,69.2 86.55,69.2 LED6.A
  Bottom 0.2: v64.9,21 v69.1,21
CD_IN  (via drill 0.4 pad 0.6)
  Top 0.2: IC3.6 63.5,27.4 v67.3,27.4 67.2,27.4 67.6,27 67.6,9 69,7.6 73,7.6 73.69,6.91 SV6.6 | v69.8,27.4 71,28.6 96,28.6 97,29.6 97,47.2 96.2,48 89.2,48 87.8,49.4 87.8,50.2 82.4,55.6 82.4,62.6 79.6,65.4 75.6,65.4 75,66 75,68.8 74.55,69.25 LED5.A
  Bottom 0.2: v67.3,27.4 v69.8,27.4
DAC_IN  (via drill 0.4 pad 0.6)
  Top 0.2: IC3.2 63.44,22.2 v65.7,22.2 65.8,22.2 66,22 66,5.8 68,3.8 70,3.8 71.15,2.65 SV6.3 | v69.9,22.2 71.4,22.2 72,22.8 72,26.6 72.4,27 96.8,27 98.6,28.8 98.6,55.4 97.6,56.4 88,56.4 85.6,58.8 85.6,64.4 85,65 85,69 84.75,69.25 LED1.A
  Bottom 0.2: v65.7,22.2 v69.9,22.2
DISPLAY_RESET  (via drill 0.4 pad 0.8)
  Top 0.2: SV2.6 7.4,62.5 8.6,61.3 8.6,54.5 9.7,53.4 9.7,50.7 10.4,50 28.4,50 29,50.6 32.6,50.6 33,50.2 38.3,50.2 v38.6,50.5
  Bottom 0.2: PCB1.13 38.61,52.79 v38.6,50.5
EXT1  (via drill 0.4 pad 0.6)
  Top 0.2: PCB1.16 41.15,62.85 v41,63 | SV11.9 27.63,76.47 28.7,75.4 28.7,72.1 29.2,71.6 33.8,71.6 35.2,70.2 35.2,67.7 36.4,66.5 40.3,66.5 v41,65.8
  Bottom 0.2: v41,63 v41,65.8
EXT2  (via drill 0.4 pad 0.6)
  Top 0.2: PCB1.18 43.69,62.91 v43.6,63 | SV11.7 30.03,76.47 31.2,75.3 31.2,72.7 31.8,72.1 33.9,72.1 35.7,70.3 35.7,68 36.8,66.9 40.9,66.9 42,65.8 v43.6,65.8
  Bottom 0.2: v43.6,63 v43.6,65.8
HEAD_OUT
  Top 0.2: IC3.8 64.75,29.85 65.2,29.4 68.4,29.4 | 68.4,29.4 68.4,9.4 69.4,8.4 73.4,8.4 74.8,7 75.8,7 76.23,6.57 SV6.8 | 68.4,29.4 95.6,29.4 96.2,30 96.2,43 95.4,43.8 89.2,43.8 86.2,46.8 86.2,49.4 80.8,54.8 80.8,61.8 78.8,63.8 73.8,63.8 70,67.6 70,68.8 69.55,69.25 LED8.A
HEADPH_PWR  (via drill 0.4 pad 0.6, 0.4 pad 0.8)
  Top 0.2: LED12.A 91.5,70.2 90.3,71.4 59.4,71.4 58.2,70.2 58.2,65 57.7,64.5 57.7,56.8 v58.1,56.4 42.8,56.4 41.15,58.05 PCB1.15 | SV4.4 17.4,6 18.2,6.8 20,6.8 23,9.8 v31.5,9.8 | v57.2,50.9 57.2,50.2 58,49.4 58,20.6 55.2,17.8 55.2,10.6 53.6,9 45.6,9 44.8,9.8 v34.5,9.8
  Bottom 0.2: v34.5,9.8 v31.5,9.8 | v57.2,50.9 57.2,51 58.5,52.3 58.5,56 v58.1,56.4
LIRC_IN
  Top 0.2: PCB1.11 36.23,58.43 37.4,59.6 41.8,59.6 42.4,59 42.4,57.8 43.4,56.8 52,56.8 52.6,57.4 52.6,59.2 52.2,59.6 50.4,59.6 50,60 50,63.2 51.6,64.8 56.2,64.8 57,65.6 57,70.8 58.8,72.6 61.6,72.6 62.1,73.1 SV10.4
N$1
  Top 0.2: IC2.1 41.72,19.52 40.6,18.4 39.94,18.4 R35.2 C20.1
N$2
  Top 0.2: LED13.C 89,66 86.8,63.8 86.8,60 87.4,59.4 90.05,59.4 R28.2
N$3
  Top 0.2: LED12.C 91.5,67.1 91,66.6 90.2,66.6 87.2,63.6 87.2,62 87.6,61.6 R24.2
N$4
  Top 0.2: LED9.C 66.5,65.05 R36.2
N$5
  Top 0.2: LED8.C 69,67 72.6,63.4 78.6,63.4 80.4,61.6 80.4,54.6 85.8,49.2 85.8,46 89,42.8 90.05,42.8 R20.2
N$6
  Top 0.2: LED7.C 71.5,66.7 74,64.2 79,64.2 81.2,62 81.2,55 86.6,49.6 86.6,47.6 89.4,44.8 R19.2
N$7
  Top 0.2: LED6.C 86.5,64.7 86,64.2 86,59 87.6,57.4 R13.2
N$8
  Top 0.2: LED3.C 79,67 79.4,66.6 80.2,66.6 83.6,63.2 83.6,56.8 89.2,51.2 90.05,51.2 R16.2
N$9
  Top 0.2: LED4.C 76.5,66.3 77,65.8 79.8,65.8 82.8,62.8 82.8,55.8 88.2,50.4 88.2,49.8 89,49 R15.2
N$10
  Top 0.2: LED5.C 74,65.4 74.4,65 79.4,65 82,62.4 82,55.4 87.4,50 87.4,48.6 89.2,46.8 90.05,46.8 R14.2 90.05,47
N$11
  Top 0.2: IC2.3 44.96,18.14 45.5,17.6 45.5,16.91 R31.2 C12.1
N$12
  Top 0.2: IC1.13 29.48,43.68 30.5,44.7 C4.1 R2.2
N$13
  Top 0.2: IC2.5 47.5,18.2 47.8,17.9 51.4,17.9 51.8,17.5 51.8,16.9 R33.2 C13.1
N$14
  Top 0.2: IC1.11 32.02,43.42 33,44.4 34.3,44.4 34.8,44.9 34.8,45.82 R4.2 36.99,45.86 C5.1
N$15
  Top 0.2: IC3.18 51.17,33.66 R23.1
N$16
  Top 0.2: IC1.9 34.56,43.46 35.4,44.3 36.3,44.3 37.2,43.4 40.8,43.4 41.3,43.9 41.3,45.83 R6.2 C6.1
N$17
  Top 0.2: Q1.1 75.5,35 76.45,34.05 Q3.1 76.65,34 77.7,34 79.65,35.95 Q4.1 | R41.1 75.03,38.78 Q1.1 | Q2.1 79.85,41.15 80.9,40.1 80.9,38.6 80.4,38.1 78.1,38.1 77,39.2 75.55,39.2 Q1.1
N$18
  Top 0.2: R8.2 23.35,37.95 24,37.3 24,36.6 24.4,36.2 25.05,36.2 C7.1 28.17,36.25 IC1.1
N$19
  Top 0.4: Q6.3 Q6.2 Q6.1 28.35,11.55 R44.2
N$20
  Top 0.2: IC1.3 30.73,36.19 30.73,34.93 30.6,34.8 27.5,34.8 26.8,34.1 25.15,34.1 C8.1 R10.2
N$21
  Bottom 1: SV11.2 39.47,73.93 41.8,71.6 47.18,71.6 K1.4
N$22
  Top 0.2: R43.2 LED11.C
N$23
  Top 0.2: R12.2 C9.1 32.7,34.2 33.3,34.8 IC1.5
N$24
  Top 0.2: R42.2 LED10.C
N$25
  Top 0.4: Q5.1 13.95,19.9 16,19.9 20.9,15 22.6,15 23.95,13.65 Q6.4 R45.2
N$26
  Top 0.4: 11.7,18.1 16.4,18.1 20.5,14 21.85,14 24.1,11.75 Q6.6
  Top 1: F1.2 C16.1 11.7,18.1 Q5.3
N$27
  Top 0.2: Q7.1 22.8,67.25 R21.1
N$28
  Top 0.4: Q7.3 31.3,66.3 32.8,67.8 32.8,69.6 K1.2
N$29
  Top 0.2: R50.2 C18.1 46.23,32.42 IC2.11
N$30
  Top 0.2: LED1.C 84,65.2 85.2,64 85.2,58.6 88.6,55.2 90.05,55.2 R18.2
N$31
  Top 0.2: IC2.13 43.69,26.96 C19.1 R52.2
N$32
  Top 0.2: R55.1 44.7,27.3 45,27 45,25.71 IC2.12
N$33
  Top 0.2: R56.1 IC2.10
N$34
  Top 0.2: LED2.C 81.5,66.5 84.4,63.6 84.4,58.2 89.4,53.2 R17.2
N$35  (via drill 0.4 pad 0.8)
  Top 0.2: v62.2,6 62.2,3 61.6,2.4 60.67,2.4 SV9.5 | v62.2,8.6 60.7,8.6 59.55,9.75 R49.2 R48.2
  Bottom 0.2: v62.2,8.6 v62.2,6
N$37  (via drill 0.4 pad 0.8)
  Top 0.2: R46.1 R47.1 61.2,14.1 60.6,13.5 57.9,13.5 57.5,13.1 57.5,9.1 57,8.6 v55.6,8.6
  Bottom 0.2: SV9.2 55.46,8.46 v55.6,8.6
PHOAMP_PWR  (via drill 0.4 pad 0.6, 0.4 pad 0.8)
  Top 0.2: PCB1.33 64.01,59.01 64.7,59.7 67.1,59.7 67.8,60.4 67.8,61.8 68,62 68,69.8 68.6,70.4 88.7,70.4 89.1,70 89.1,69.35 LED13.A | v62.4,56.4 62.4,39 61.6,38.2 61.6,37.6 61.4,37.4 59.6,37.4 58.8,36.6 58.8,20.2 56,17.4 56,10.2 54,8.2 44,8.2 43.6,8.6 v35.6,8.6 | SV8.4 30.9,4.5 31.6,3.8 35.2,3.8 35.6,4.2 v35.6,6
  Bottom 0.2: PCB1.33 64,56.8 63.6,56.4 v62.4,56.4 | v35.6,6 v35.6,8.6
PHONO_IN  (via drill 0.4 pad 0.6)
  Top 0.2: IC3.3 63.51,23.4 v65,23.4 66,23.4 66.4,23 66.4,8.4 68.61,6.19 SV6.2 | v69.1,23.4 71,23.4 71.6,24 71.6,27 72,27.4 96.6,27.4 98.2,29 98.2,53.2 97.2,54.2 89,54.2 84.8,58.4 84.8,63.8 82.4,66.2 82.4,69 82.15,69.25 LED2.A
  Bottom 0.2: v65,23.4 v69.1,23.4
PORTABLE_IN  (via drill 0.4 pad 0.6)
  Top 0.2: IC3.4 63.44,24.8 v66.5,24.8 66.4,24.8 66.8,24.4 66.8,8.6 68.6,6.8 70.6,6.8 71.15,6.25 SV6.4 | v69.9,24.8 70.8,24.8 71.2,25.2 71.2,27.4 71.6,27.8 96.4,27.8 97.8,29.2 97.8,51.2 96.8,52.2 89.4,52.2 84,57.6 84,63.4 80,67.4 80,68.8 79.6,69.2 79.05,69.2 LED3.A
  Bottom 0.2: v66.5,24.8 v69.9,24.8
PREAMP_PWR  (via drill 0.4 pad 0.6, 0.4 pad 0.8)
  Top 0.2: PCB1.29 58.93,58.73 60.2,60 60.2,63.4 58.6,65 58.6,70 59.6,71 65.8,71 66.4,70.4 66.4,69.35 LED9.A | v58.4,50.9 58.4,20.4 55.6,17.6 55.6,10.4 53.8,8.6 44.9,8.6 v44.4,9.1
  Bottom 0.2: SV5.4 v44.4,9.1 | PCB1.29 58.93,51.43 v58.4,50.9
RENC_CLK/D
  Top 0.2: SV1.2 78.14,72.4 77.54,71.8 59.2,71.8 57.8,70.4 57.8,65.2 56.6,64 54.4,64 53.85,63.45 PCB1.26
RENC_LR/U
  Top 0.2: SV1.4 73.87,72.2 59,72.2 57.4,70.6 57.4,65.4 56.4,64.4 52.2,64.4 51.31,63.51 PCB1.24
RXD0  (via drill 0.4 pad 0.6, 0.4 pad 0.8)
  Top 0.2: v47.4,39.4 47.4,29.95 R56.2 | v47.6,43 48.6,43 49.8,44.2 49.8,50.2 v50.6,51 | v50.6,54 50.6,54.9 49.55,55.95 37.65,55.95 37.4,56.2 36.25,56.2 R54.2 36.15,56.2 35.1,56.2 34.7,56.6 34.7,59.8 PCB1.10
  Bottom 0.2: v47.6,43 47.4,43 46.8,42.4 46.8,40 v47.4,39.4 | v50.6,54 50.5,54 49.8,53.3 49.8,51.8 v50.6,51
RXD0_C  (via drill 0.4 pad 0.6, 0.4 pad 0.8)
  Top 0.2: v19.1,70.2 19.1,67.5 13.8,62.2 13.8,56.5 14.7,55.6 v22.3,55.6 | R29.1 R50.1 43.8,35.8 45,37 v45,39.4 | v45.2,43 46.4,44.2 48.4,44.2 49,44.8 49,50.2 v48.2,51 | v48.2,54 48.2,54.5 47.9,54.8 37.4,54.8 37.1,54.5 36.25,54.5 R54.1 33.65,54.55 33.1,55.1 31.2,55.1 v30.7,55.6
  Bottom 0.2: SV13.2 19.04,70.26 v19.1,70.2 | v45.2,43 45.4,43 46,42.4 46,40.4 v45,39.4 | v48.2,54 48.4,54 49,53.4 49,51.8 v48.2,51 | v30.7,55.6 v22.3,55.6
SCL  (via drill 0.4 pad 0.8)
  Top 0.2: 79.25,34.05 Q4.2 78.65,32.9 75.3,32.9 74.4,33.8 Q3.3 | 74.33,34.93 Q3.3 | SV2.4 8.76,65.04 9.6,64.2 9.6,54.8 13.2,51.2 27.7,51.2 28.3,51.8 28.4,51.8 | 28.4,51.8 59.1,51.8 59.5,51.4 59.5,38.5 v59.2,38.2 | 28.4,51.8 28.4,58.38 PCB1.5 | Q3.3 73.75,35.65 R38.1 72.15,35.6 71.2,35.6 70.5,36.3 67.1,36.3 65.73,34.93 IC3.12 61.93,34.93 v61.6,34.6 | v60,34.6 60,31.8 60.2,31.6 60.2,30.6 59.5,29.9 R48.1
  Bottom 0.2: v59.2,38.2 59.2,34.9 59.5,34.6 v60,34.6 v61.6,34.6
SCL5  (via drill 0.4 pad 0.8)
  Top 0.2: 76.65,36 Q3.2 76.6,36.6 77.4,37.4 81.3,37.4 82,36.7 Q4.3 84.05,35 R39.1 84.3,31.1 v85,30.4 84.98,30.42 | SV6.11 82.58,3.8 87.2,3.8 88,4.6 88,21.6 85.6,24 v85,24 84.2,24 83.8,24.4 76.2,24.4 75.2,23.4 75.2,20.6 70,15.4 v69.1,15.4 | R49.1 62,12.6 v64.8,15.4
  Bottom 0.2: v85,30.4 v85,24 | v64.8,15.4 v69.1,15.4
SDA  (via drill 0.4 pad 0.8)
  Top 0.2: IC3.13 64,36.2 | 64,36.2 65.9,36.2 67.4,37.7 68.98,37.7 R37.1 69,39.3 69.9,40.2 Q1.3 77.4,40.2 78.4,39.2 79.75,39.2 Q2.2 | SV2.2 8.92,67.58 11,65.5 11,55.4 13.8,52.6 26.4,52.6 27,53.2 27,56.3 25.91,57.39 PCB1.3 27.08,59.6 29.5,59.6 29.8,59.3 29.8,53.6 30.2,53.2 59.8,53.2 60.9,52.1 v61.3,39 | IC3.13 | 63.9,36.3 64,36.2 | IC3.13 63.31,36.3 v61.3,36.3 61.3,35.3 60.9,34.9 60.9,34 61.4,33.5 61.4,30 60.9,29.5 60.9,19.6 61.2,19.3 R47.2
  Bottom 0.2: v61.3,39 v61.3,36.3
SDA5  (via drill 0.4 pad 0.8)
  Top 0.2: Q1.2 75.5,41.5 76.2,42.2 81.34,42.2 82,41.54 Q2.3 83.75,40.2 R40.1 87.15,39.65 87.8,39 v87.8,30.4 | v69.1,18 70.6,18 73.8,21.2 73.8,24.2 75.4,25.8 v87.8,25.8 87.8,24 89.6,22.2 89.6,3.4 88.73,2.53 SV6.15 | v64.8,18 63.7,16.9 R46.2
  Bottom 0.2: v87.8,25.8 v87.8,30.4 | v64.8,18 v69.1,18
SW0
  Top 0.2: R6.1 41.34,47.57 R5.1 39.2,48.4 37.8,49.8 32.8,49.8 32.4,50.2 29.2,50.2 28.6,49.6 10.4,49.6 9,48.2 9,45.96 8.2,45.16 SV3.2
SW1
  Top 0.2: R4.1 32.72,47.56 R3.1 32.7,47.6 32.7,49.1 32,49.8 29.4,49.8 28.8,49.2 10.6,49.2 9.4,48 9.4,43.2 8.8,42.6 6.79,42.6 SV3.4
SW2
  Top 0.2: R2.1 R1.1 25.98,48.42 25.6,48.8 10.8,48.8 9.8,47.8 9.8,41 8.8,40 6.85,40 SV3.6
SW3
  Top 0.2: SV3.12 8.27,32.46 11.43,29.3 24.9,29.3 26.7,31.1 26.7,33 27.05,33.35 R11.1 29.05,33.35 29.4,33 29.4,32 29.8,31.6 30.45,31.6 R12.1
SW4
  Top 0.2: SV3.8 8.56,37.54 9.9,36.2 20.65,36.2 R7.1 R8.1
SW5
  Top 0.2: SV3.10 8.27,35 8.27,33.83 9.8,32.3 20.65,32.3 R9.1 R10.1
SW6
  Top 0.2: SV3.16 8.98,27.38 10.1,28.5 25.5,28.5 27.1,26.9 34.4,26.9 35.5,25.8 35.5,15.9 36.3,15.1 40.4,15.1 40.9,15.6 40.9,17.1 41.5,17.7 44,17.7 44.4,17.3 44.4,15.12 | R31.1 44.4,15.12 | R30.1 44.4,15.12
SW7
  Top 0.2: SV3.14 6.79,29.9 8.3,29.9 9.3,28.9 25.7,28.9 27,27.6 34.8,27.6 36.2,26.2 36.2,19.4 37.2,18.4 R35.1 R34.1
SW8
  Top 0.2: R33.1 R32.1 49.6,15.08 | 51.7,15.1 R33.1 | R33.1 51.8,15.05 51.8,9.8 51.4,9.4 45.8,9.4 45,10.2 35.6,10.2 34.8,11 34.8,25.5 34,26.3 27,26.3 25.2,28.1 11.4,28.1 8.1,24.8 6.81,24.8 SV3.18
TXD0  (via drill 0.4 pad 0.6, 0.4 pad 0.8)
  Top 0.2: R55.2 44.7,31.3 44.3,31.7 43.2,31.7 42.8,32.1 42.8,33.4 43,33.6 44.7,33.6 44.9,33.8 44.9,36 46.2,37.3 v46.2,39.4 | v46.4,43 46.4,43.1 47.1,43.8 48.6,43.8 49.4,44.6 v49.4,51 | PCB1.8 30.99,60.91 32.3,59.6 R53.2 32.85,55.95 33.4,55.4 48.7,55.4 49.4,54.7 v49.4,54
  Bottom 0.2: v46.4,43 46.4,39.6 v46.2,39.4 | v49.4,51 v49.4,54
TXD0_C  (via drill 0.4 pad 0.6, 0.4 pad 0.8)
  Top 0.2: R52.1 R51.1 38.1,31 38.9,31.8 42.1,31.8 42.3,32 42.3,33.4 42.1,33.6 40.6,33.6 40.3,33.9 40.3,35.9 40.5,36.1 42.5,36.1 43.8,37.4 v43.8,39.4 | v15.2,70.2 15.5,70.5 17.7,70.5 18.1,70.1 18.1,67.4 13.2,62.5 13.2,56.3 14.4,55.1 21.4,55.1 22.1,54.4 v22.3,54.4 | v44,43 45.6,44.6 48.2,44.6 48.6,45 48.6,49.3 47,50.9 v47,51 | v47,54 38,54 37.7,53.7 34,53.7 33.5,54.2 32.35,54.2 R53.1 30.85,54.25 v30.7,54.4
  Bottom 0.2: SV13.5 13.96,76.34 15.2,75.1 v15.2,70.2 | v44,43 44,42.6 44.3,42.3 45.3,42.3 45.6,42 45.6,40.6 45.1,40.1 44.5,40.1 v43.8,39.4 | v47,54 47,53.6 47.3,53.3 48.4,53.3 48.6,53.1 48.6,52 48.3,51.7 47.7,51.7 v47,51 | v30.7,54.4 29.9,55.2 23.1,55.2 v22.3,54.4
VCC
  Top 1: X1.1 11.59,11.36 F1.1
VOL_CLK/D  (via drill 0.4 pad 0.6)
  Top 0.2: PCB1.7 30.99,58.91 29.7,60.2 29.7,62.4 30.3,63 39.4,63 40.1,63.7 v42.3,63.7 | SV7.2 51.04,73.14 50.3,72.4 47.7,72.4 47.2,72.9 47.2,74.6 46.6,75.2 43.1,75.2 42.3,74.4 v42.3,68.4
  Bottom 0.2: v42.3,63.7 v42.3,68.4
VOL_I2C_EN
  Top 0.2: R41.2 71.28,41.6 67.1,41.6 65.9,40.4 63.9,40.4 63.3,41 63.3,56.7 62.8,57.2 62.8,59.64 PCB1.32
VOL_LR/U  (via drill 0.4 pad 0.6)
  Top 0.2: SV7.4 48.5,74.7 49,75.2 v52.9,75.2 | v56.1,75.2 66.4,75.2 67.4,74.2 v67.4,73.2 | v67.4,70.4 67.4,69.4 67.6,69.2 67.6,62.2 66.8,61.4 66.8,61.22 PCB1.36
  Bottom 0.2: v52.9,75.2 v56.1,75.2 | v67.4,73.2 v67.4,70.4

### Text on the board
tPlace: Entworfn / in / Franggn
tNames: UART | AMBILIGHT+EXT | VOL ENC | LIRC | ROT ENC | TX | Kontroll- / bladdn v2 / sld 2017 | DISPLAY | 3V3 | 5V | SWITCH CON | GND | 5V | VOL | HEAD | PHO | PRE | SOURCE / BOARD